# Altium schematic sheet LCD.SchDoc
size A4; SheetNumber: 0; SheetTotal: 0
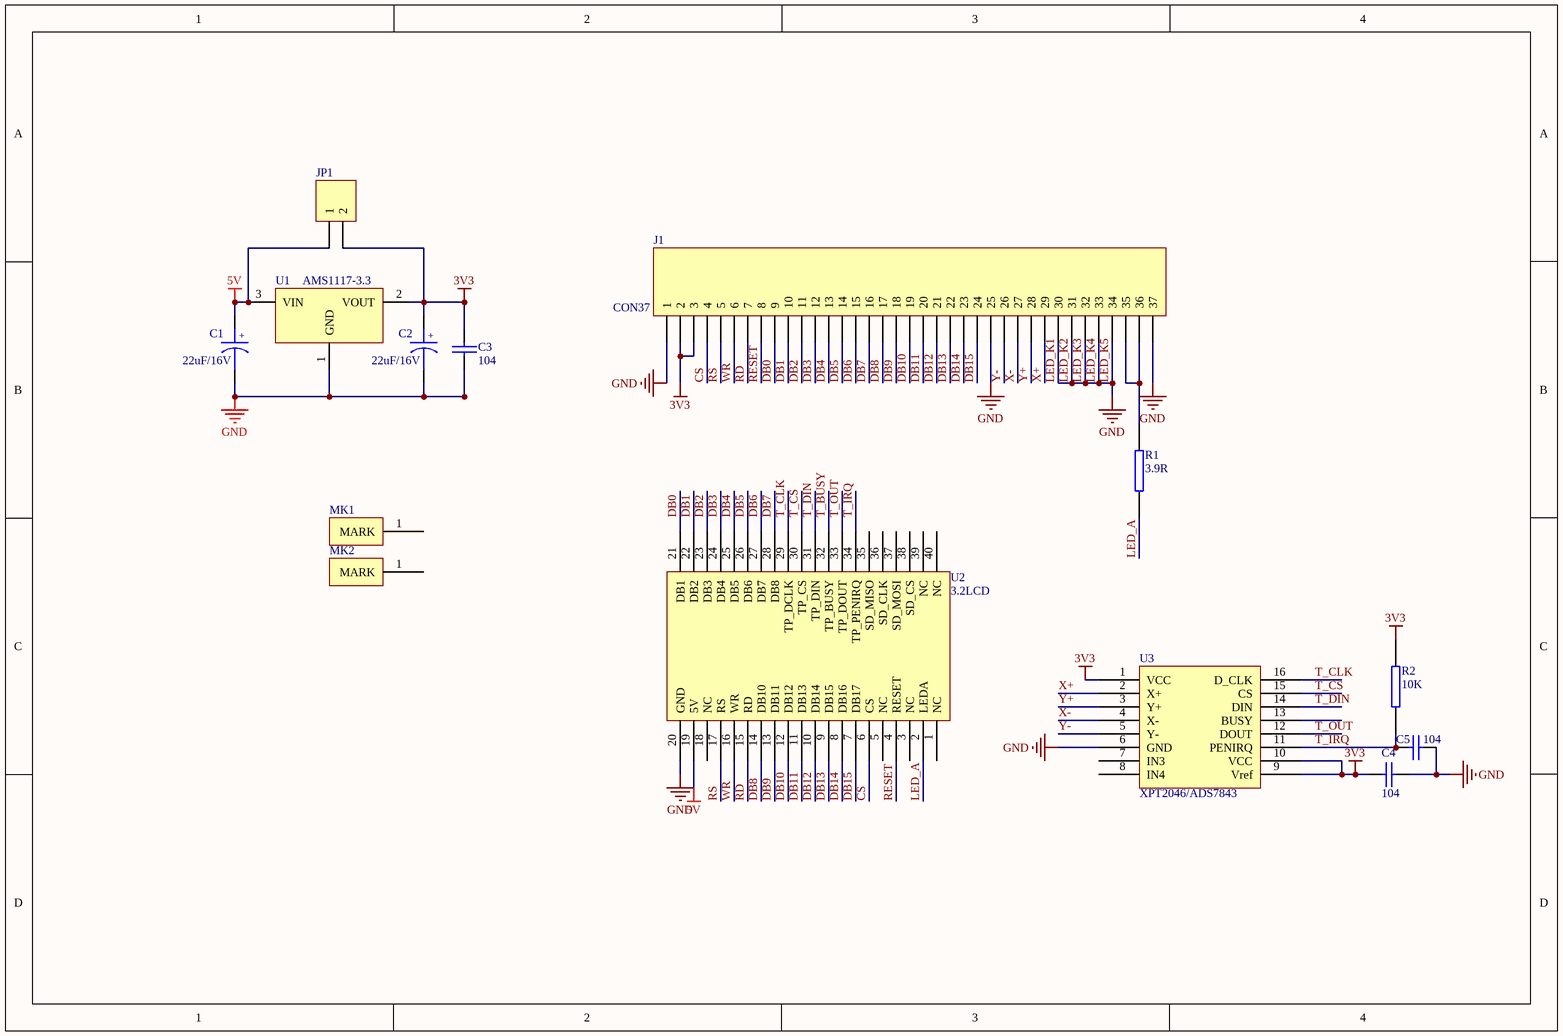
[diagram p0: LCD.SchDoc]

## Parts
C1  22uF/16V  [0805C]
C2  22uF/16V  [0805C]
C3  104  [C0603]
C4  104  [C0603]
C5  104  [C0603]
J1  CON37  [3.2_37PIN_ILI9341B]
JP1  (no value)  [J]
MK1  (no value)  [MARK]
MK2  (no value)  [MARK]
R1  3.9R  [R0603]
R2  10K  [R0603]
U1  AMS1117-3.3  [SOT-223/P2.3]
U2  3.2LCD  [LCD-DIP]
U3  XPT2046/ADS7843  [TSSOP-16]

## Nets
3V3: C2.1 C3.1 C4.1 J1.2 J1.3 JP1.2 R2.1 U1.2(VOUT) U3.1(VCC) U3.9(Vref) U3.10(VCC)
5V: C1.1 JP1.1 U1.3(VIN) U2.19(5V)
LED_K1: C1.2 C2.2 C3.2 C4.2 C5.2 J1.1 J1.25 J1.30 J1.31 J1.32 J1.33 J1.34 J1.37 U1.1(GND) U2.20(GND) U3.6(GND)  [also labelled GND, LED_K2, LED_K3, LED_K4, LED_K5]
CS: J1.4 U2.6(CS)
DB0: J1.9 U2.21(DB1)
DB1: J1.10 U2.22(DB2)
DB2: J1.11 U2.23(DB3)
DB3: J1.12 U2.24(DB4)
DB4: J1.13 U2.25(DB5)
DB5: J1.14 U2.26(DB6)
DB6: J1.15 U2.27(DB7)
DB7: J1.16 U2.28(DB8)
DB8: J1.17 U2.14(DB10)
DB9: J1.18 U2.13(DB11)
DB10: J1.19 U2.12(DB12)
DB11: J1.20 U2.11(DB13)
DB12: J1.21 U2.10(DB14)
DB13: J1.22 U2.9(DB15)
DB14: J1.23 U2.8(DB16)
DB15: J1.24 U2.7(DB17)
LED_A: R1.1 U2.2(LEDA)
RD: J1.7 U2.15(RD)
RESET: J1.8 U2.4(RESET)
RS: J1.5 U2.17(RS)
T_BUSY: U2.32(TP_BUSY)
T_CLK: U2.29(TP_DCLK) U3.16(D_CLK)
T_CS: U2.30(TP_CS) U3.15(CS)
T_DIN: U2.31(TP_DIN) U3.14(DIN)
T_IRQ: C5.1 R2.2 U2.34(TP_PENIRQ) U3.11(PENIRQ)
T_OUT: U2.33(TP_DOUT) U3.12(DOUT)
WR: J1.6 U2.16(WR)
X+: J1.29 U3.2(X+)
X-: J1.27 U3.4(X-)
Y+: J1.28 U3.3(Y+)
Y-: J1.26 U3.5(Y-)
NetJ1_35: J1.35 J1.36 R1.2

Not connected (* = marked no-connect by the designer): MK1 1(MARK); MK2 1(MARK); U2 1(NC) 3(NC) 5(NC) 18(NC) 35(SD_MISO) 36(SD_CLK) 37(SD_MOSI) 38(SD_CS) 39(NC) 40(NC); U3 7(IN3) 8(IN4) 13(BUSY)

## Notes on the sheet
- (in symbol CAPACITOR POL) +

## Library data of the parts
C1 C2 = CAPACITOR POL: Capacitor
C3-C5 = CAP: Capacitor
J1 = Header 37: Header, 6-Pin; LatestRevisionDate: 17-Jul-2002; LatestRevisionNote: Re-released for DXP Platform.; Publisher: Altium Limited
JP1 = Header 2: Header, 2-Pin; LatestRevisionDate: 17-Jul-2002; LatestRevisionNote: Re-released for DXP Platform.; Publisher: Altium Limited
MK1 MK2 = MARK
R1 R2 = RES2
U1 = AMS1117
U3 = XPT2046